# EAGLE design DicioBkUP (EAGLE 7.5.0)
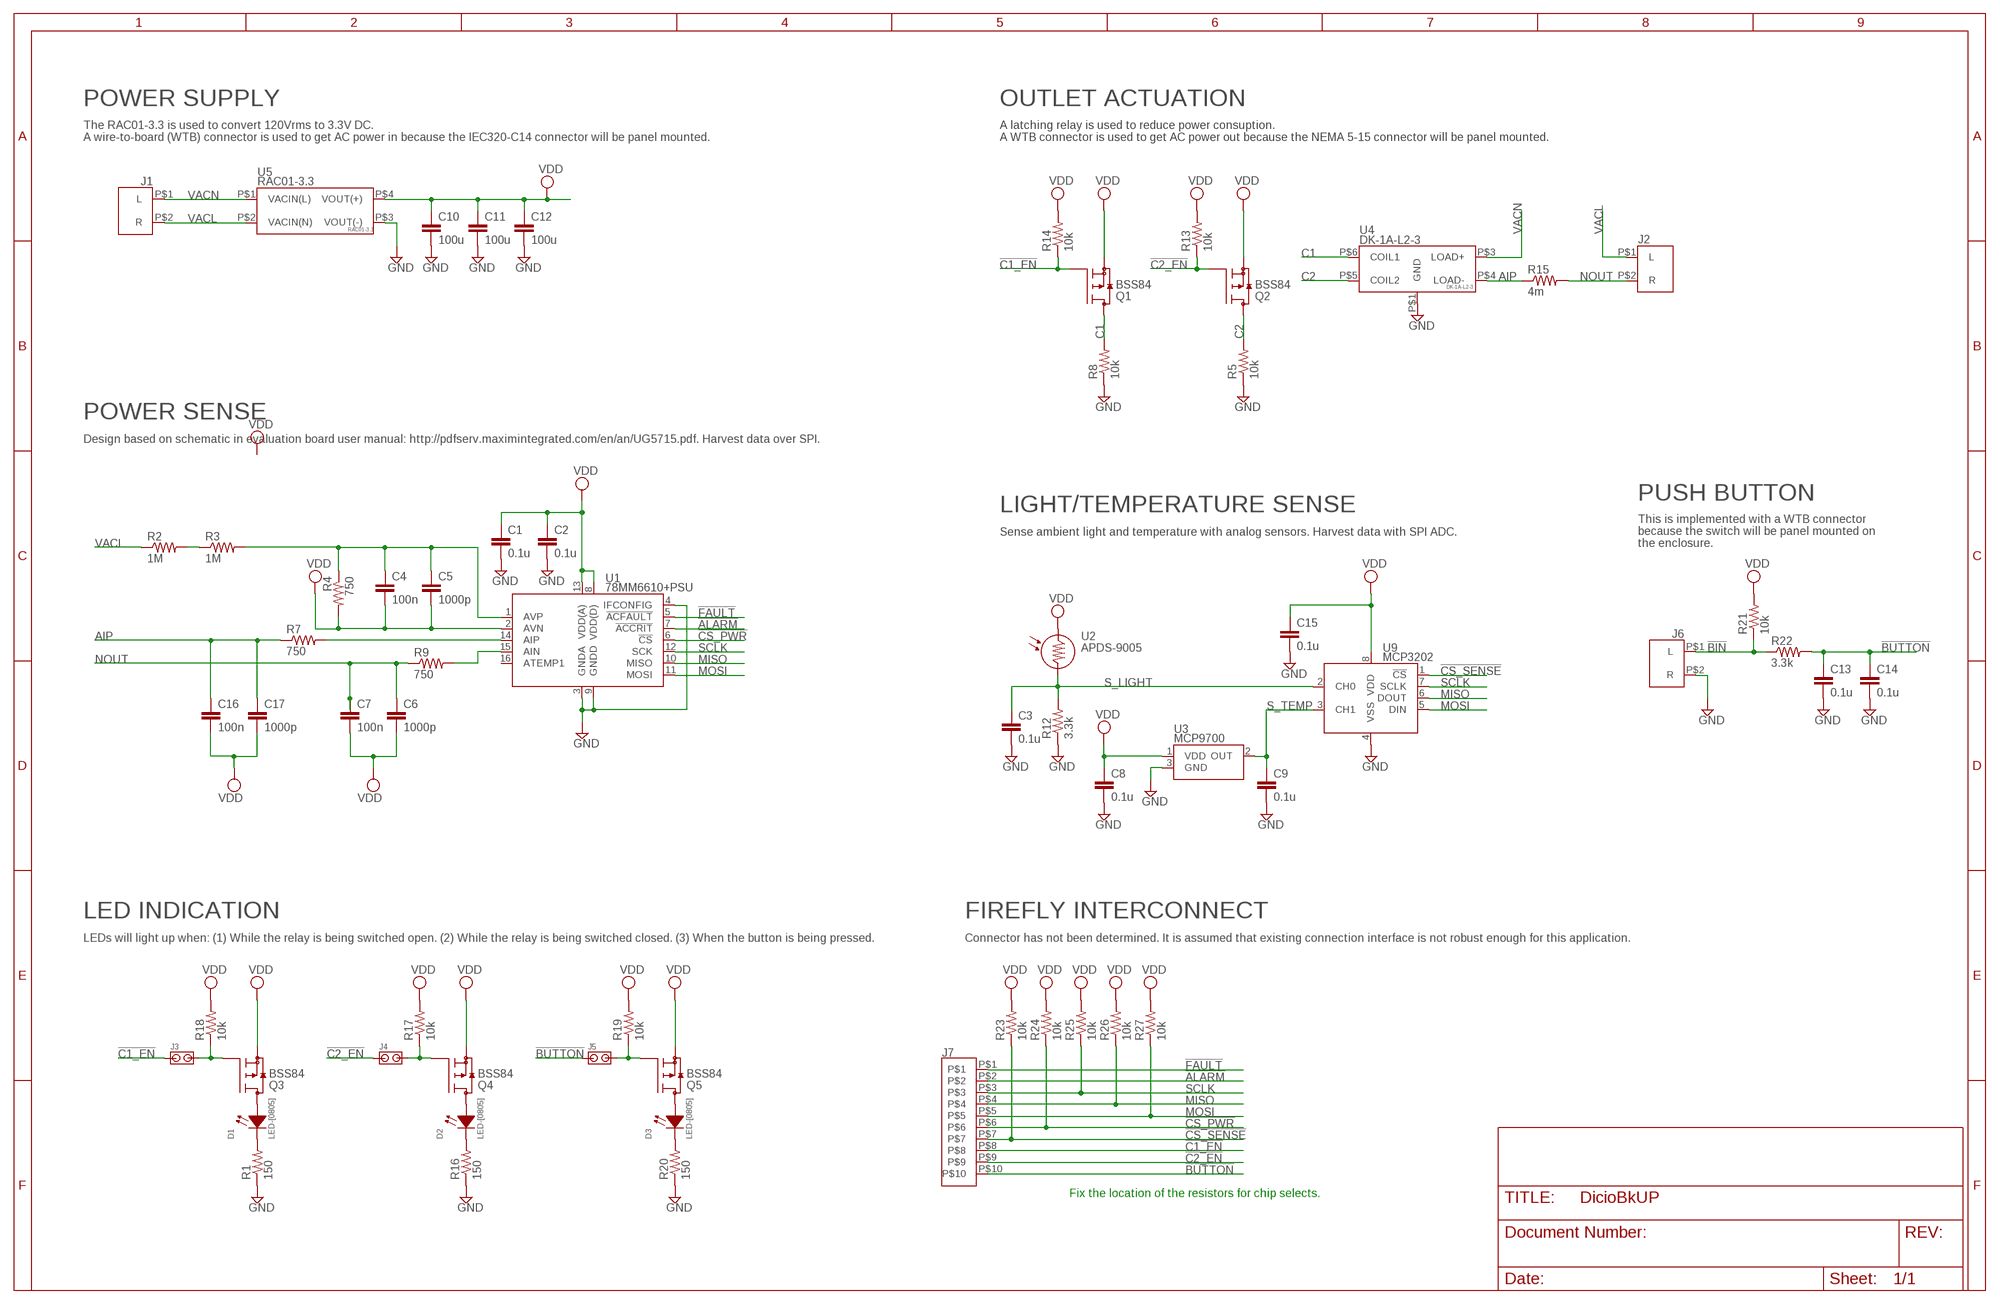
[diagram p0: schematic, sheet 1]

## Parts
C1  0.1u  C-EUC0805  [C0805]
C2  0.1u  C-EUC0805  [C0805]
C3  0.1u  C-EUC0805  [C0805]
C4  100n  C-EUC0805  [C0805]
C5  1000p  C-EUC0805  [C0805]
C6  1000p  C-EUC0805  [C0805]
C7  100n  C-EUC0805  [C0805]
C8  0.1u  C-EUC0805  [C0805]
C9  0.1u  C-EUC0805  [C0805]
C10  100u  C-EUC1206  [C1206]
C11  100u  C-EUC1206  [C1206]
C12  100u  C-EUC1206  [C1206]
C13  0.1u  C-EUC0805  [C0805]
C14  0.1u  C-EUC0805  [C0805]
C15  0.1u  C-EUC0805  [C0805]
C16  100n  C-EUC0805  [C0805]
C17  1000p  C-EUC0805  [C0805]
D1  LED-[0805]  [L0805]
D2  LED-[0805]  [L0805]
D3  LED-[0805]  [L0805]
J1  WTB-2  [[TERM][2][0.2]]
J2  WTB-2  [[TERM][2][0.2]]
J3  JMP2  [JMP2]
J4  JMP2  [JMP2]
J5  JMP2  [JMP2]
J6  WTB-2  [[TERM][2][0.2]]
J7  TERM10  [TERM10]
Q1  BSS84  [SOT23]
Q2  BSS84  [SOT23]
Q3  BSS84  [SOT23]
Q4  BSS84  [SOT23]
Q5  BSS84  [SOT23]
R1  150  R-US_R0805  [R0805]
R2  1M  R-US_R0805  [R0805]
R3  1M  R-US_R0805  [R0805]
R4  750  R-US_R0805  [R0805]
R5  10k  R-US_R0805  [R0805]
R7  750  R-US_R0805  [R0805]
R8  10k  R-US_R0805  [R0805]
R9  750  R-US_R0805  [R0805]
R12  3.3k  R-US_R0805  [R0805]
R13  10k  R-US_R0805  [R0805]
R14  10k  R-US_R0805  [R0805]
R15  4m  R-US_R2512  [R2512]
R16  150  R-US_R0805  [R0805]
R17  10k  R-US_R0805  [R0805]
R18  10k  R-US_R0805  [R0805]
R19  10k  R-US_R0805  [R0805]
R20  150  R-US_R0805  [R0805]
R21  10k  R-US_R0805  [R0805]
R22  3.3k  R-US_R0805  [R0805]
R23  10k  R-US_R0805  [R0805]
R24  10k  R-US_R0805  [R0805]
R25  10k  R-US_R0805  [R0805]
R26  10k  R-US_R0805  [R0805]
R27  10k  R-US_R0805  [R0805]
U1  78MM6610+PSU  [TSSOP16]
U2  APDS-9005  [APDS-9005]
U3  MCP9700  [SOT23]
U4  DK-1A-L2-3  [DK-1A-L2-3]
U5  RAC01-3.3  [RAC01-3.3]
U9  MCP3202  [MSOP-8[MCP3202]]

## Nets
!ALARM!: J7.P$2 U1.7(!ACCRIT!)
!BIN!: J6.P$1(L) R21.1 R22.1
!BUTTON!: C13.1 C14.1 J5.P$2 J7.P$10 R22.2
!C1_EN!: J3.P$2 J7.P$8 Q1.1(G) R14.1
!C2_EN!: J4.P$2 J7.P$9 Q2.1(G) R13.1
!CS_PWR!: J7.P$6 R24.1 U1.6(!CS!)
!CS_SENSE!: J7.P$7 R23.1 U9.1(!CS!)
!FAULT!: J7.P$1 U1.5(!ACFAULT!)
AIP: C16.1 C17.1 R7.1 R15.1 U4.P$4(LOAD-)
C1: Q1.3(D) R8.2 U4.P$6(COIL1)
C2: Q2.3(D) R5.2 U4.P$5(COIL2)
GND: C1.2 C2.2 C3.2 C8.2 C9.2 C10.2 C11.2 C12.2 C13.2 C14.2 C15.2 J6.P$2(R) R1.1 R5.1 R8.1 R12.1 R16.1 R20.1 U1.3(GNDA) U1.4(IFCONFIG) U1.9(GNDD) U3.3(GND) U4.P$1(GND) U5.P$3(VOUT(-)) U9.4(VSS)
MISO: J7.P$4 R26.1 U1.10(MISO) U9.6(DOUT)
MOSI: J7.P$5 R27.1 U1.11(MOSI) U9.5(DIN)
N$1: C4.1 C5.1 R3.2 R4.1 U1.1(AVP)
N$2: J3.P$1 Q3.1(G) R18.1
N$3: R2.2 R3.1
N$5: D2.1(A) Q4.3(D)
N$6: J4.P$1 Q4.1(G) R17.1
N$7: D1.1(A) Q3.3(D)
N$10: D1.2(C) R1.2
N$11: D2.2(C) R16.2
N$12: J5.P$1 Q5.1(G) R19.1
N$13: D3.1(A) Q5.3(D)
N$14: D3.2(C) R20.2
N$15: R7.2 U1.14(AIP)
N$17: R9.2 U1.15(AIN)
NOUT: C6.1 C7.1 J2.P$2(R) R9.1 R15.2
S_LIGHT: C3.1 R12.2 U2.6(ROUT) U9.2(CH0)
S_TEMP: C9.1 U3.2(OUT) U9.3(CH1)
SCLK: J7.P$3 R25.1 U1.12(SCK) U9.7(SCLK)
VACL: J1.P$2(R) J2.P$1(L) R2.1 U5.P$2(VACIN(N))
VACN: J1.P$1(L) U4.P$3(LOAD+) U5.P$1(VACIN(L))
VDD: C1.1 C2.1 C4.2 C5.2 C6.2 C7.2 C8.1 C10.1 C11.1 C12.1 C15.1 C16.2 C17.2 Q1.2(S) Q2.2(S) Q3.2(S) Q4.2(S) Q5.2(S) R4.2 R13.2 R14.2 R17.2 R18.2 R19.2 R21.2 R23.2 R24.2 R25.2 R26.2 R27.2 U1.2(AVN) U1.8(VDD(D)) U1.13(VDD(A)) U2.1(VDD) U3.1(VDD) U5.P$4(VOUT(+)) U9.8(VDD)
Unconnected: U1.16(ATEMP1) U2.2(NC1) U2.3(NC2) U2.4(NC3) U2.5(NC4)

## Notes on the sheet
- POWER SUPPLY | OUTLET ACTUATION
- The RAC01-3.3 is used to convert 120Vrms to 3.3V DC.
  A wire-to-board (WTB) connector is used to get AC power in because the IEC320-C14 connector will be panel mounted.
- A latching relay is used to reduce power consuption.
  A WTB connector is used to get AC power out because the NEMA 5-15 connector will be panel mounted.
- POWER SENSE
- Design based on schematic in evaluation board user manual: http://pdfserv.maximintegrated.com/en/an/UG5715.pdf. Harvest data over SPI.
- PUSH BUTTON
- LIGHT/TEMPERATURE SENSE
- Sense ambient light and temperature with analog sensors. Harvest data with SPI ADC.
- This is implemented with a WTB connector
  because the switch will be panel mounted on 
  the enclosure.
- LED INDICATION | FIREFLY INTERCONNECT
- LEDs will light up when: (1) While the relay is being switched open. (2) While the relay is being switched closed. (3) When the button is being pressed. | Connector has not been determined. It is assumed that existing connection interface is not robust enough for this application.
- Fix the location of the resistors for chip selects.

## Library data of the parts
C1-C9 C13-C17 = resistor:C-EU: CAPACITOR, European symbol; DKPN: 399-1249-1-ND
C10-C12 = resistor:C-EU: CAPACITOR, European symbol; DKPN: 490-7217-1-ND
D1 = TORO:LED-[0805]; COLOR: GREEN; DKPN: 160-1218-1-ND
D2 = TORO:LED-[0805]; COLOR: RED; DKPN: 475-1415-1-ND
D3 = TORO:LED-[0805]; COLOR: YELLOW; DKPN: 475-2560-1-ND
J1 J2 J6 = TORO:WTB-2; DKPN: ED2580-ND
J3-J5 = TORO:JMP2; DKPN: S1011EC-02-ND
J7 = TORO:TERM10
Q1-Q5 = TORO:BSS84; DKPN: BSS84CT-ND
R1 R16 R20 = resistor:R-US_: RESISTOR, American symbol; DKPN: 311-150ARCT-ND
R2 R3 = resistor:R-US_: RESISTOR, American symbol; DKPN: 311-1.00MCRCT-ND
R4 R7 R9 = resistor:R-US_: RESISTOR, American symbol; DKPN: 311-750ARCT-ND
R5 R8 R13 R14 R17-R19 R21 R23-R27 = resistor:R-US_: RESISTOR, American symbol; DKPN: 311-10KARCT-ND
R12 R22 = resistor:R-US_: RESISTOR, American symbol; DKPN: 311-3.30KCRCT-ND
R15 = resistor:R-US_: RESISTOR, American symbol; DKPN: 696-1181-1-ND
U1 = TORO:78MM6610+PSU; DKPN: 78M6610+PSU/C48-ND
U2 = TORO:APDS-9005; DKPN: 516-1717-1-ND
U3 = TORO:MCP9700; DKPN: MCP9700T-E/TTCT-ND
U4 = TORO:DK-1A-L2-3; DKPN: 255-2053-ND
U5 = TORO:RAC01-3.3; DKPN: 945-1400-5-ND
U9 = TORO:MCP3202; DKPN: MCP3202-CI/SN-ND

## Board
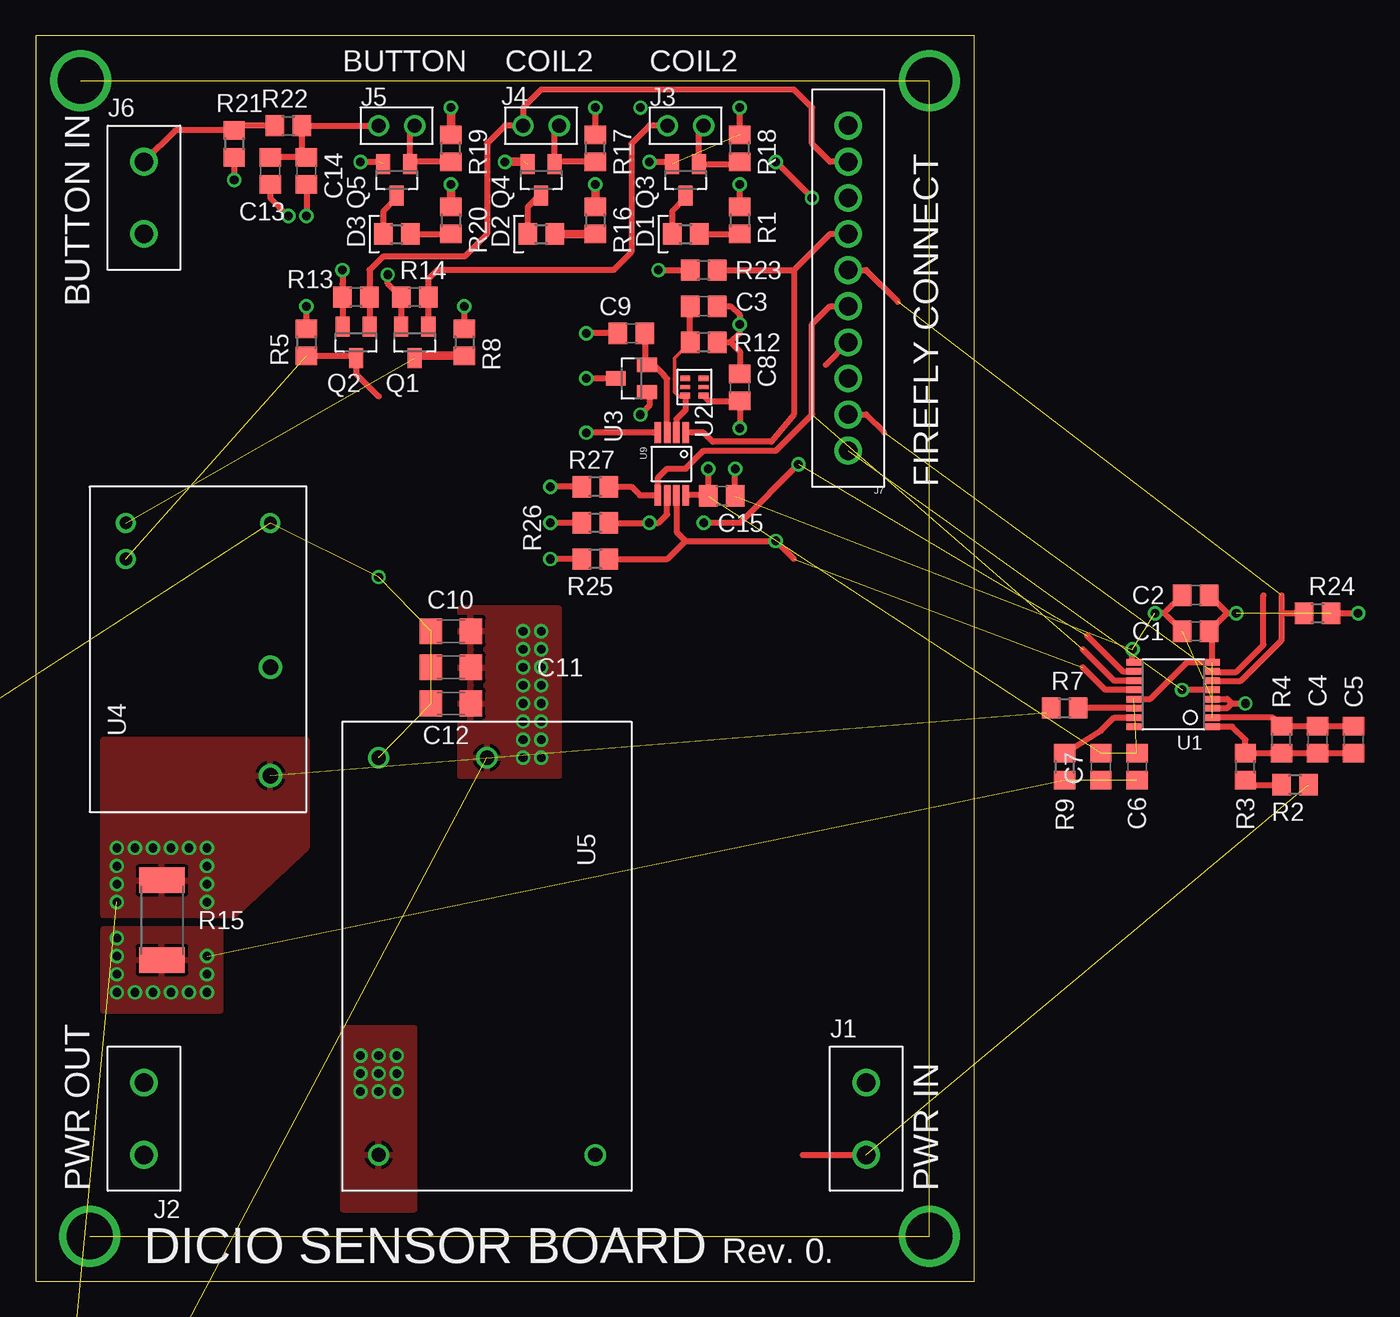
[diagram p1: board, top side]
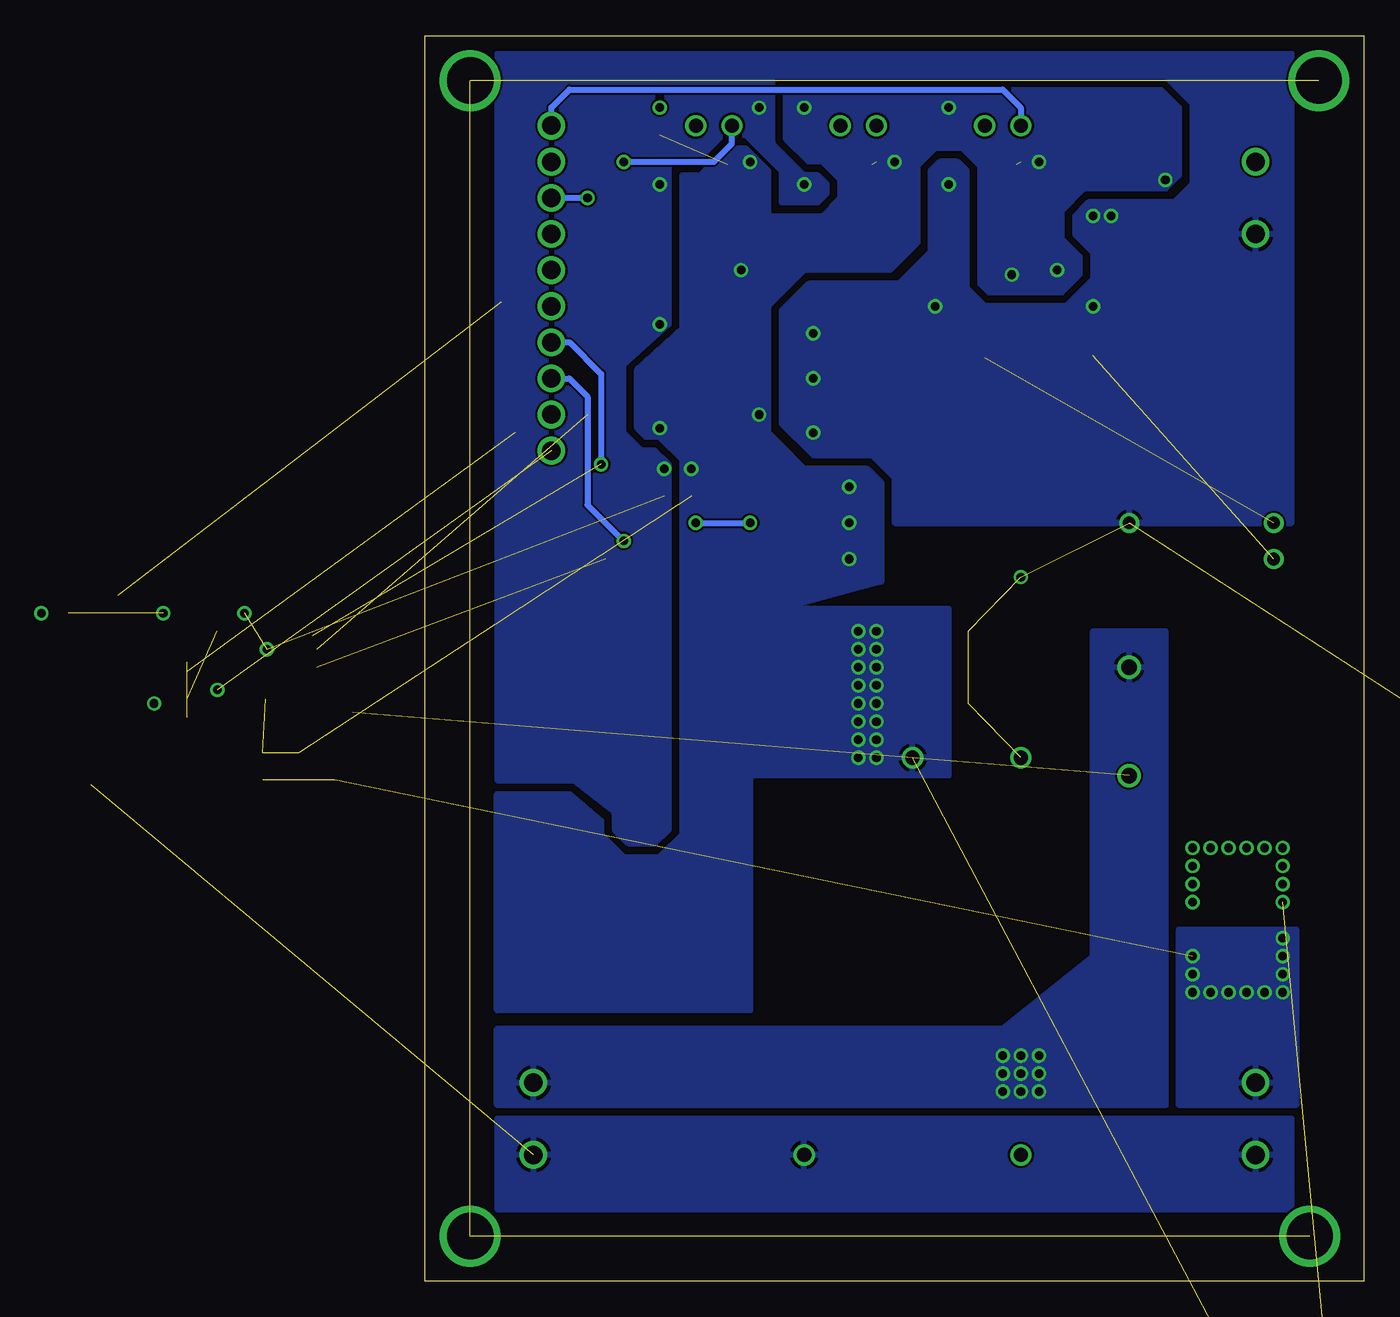
[diagram p2: board, bottom side, seen from below]

Size 66.04 x 87.62 mm. Coordinates in mm from the lower left corner, seen from the top.
Outline: 0,0 66.04,0 66.04,87.62 0,87.62 0,0
Copper layers (1*16): Top 0.035mm / dielectric 1.5mm / Bottom 0.035mm
Design rules "default *": minimum track width 10mil, minimum drill 20mil, track to track 6mil, track to pad 6mil, pad to pad 6mil, via to via 6mil, smd to smd 6mil, copper to edge 40mil, drill to drill 8mil, minimum pad ring 10mil, minimum via ring 8mil, stop-mask expansion 4mil, vias tented up to drill 0mil, thermal gap 10mil

### Footprints (pad centres in the part's own frame; a part is rotated, then mirrored left to right if it is on the bottom)
C0805 = smd 1.3 x 1.5: 1 -0.95,0; 2 0.95,0
C1206 = smd 1.6 x 1.8: 1 -1.4,0; 2 1.4,0
L0805 = smd 1.3 x 1.5: 1 -0.95,0; 2 0.95,0
[TERM][2][0.2] = drill 1.3: P$1 0,0; P$2 0,-5.08
JMP2 = drill 0.991: P$1 0,0; P$2 0,-2.54
TERM10 = drill 1.3: P$1 0,0; P$2 0,-2.54; P$3 0,-5.08; P$4 0,-7.62; P$5 0,-10.16; P$6 0,-12.7; P$7 0,-15.24; P$8 0,-17.78; P$9 0,-20.32; P$10 0,-22.86
SOT23 = smd 1 x 1.4: 1 -0.95,-1.1; 2 0.95,-1.1; 3 0,1.1
R0805 = smd 1.3 x 1.5: 1 -0.95,0; 2 0.95,0
R2512 = smd 1.8 x 3.2: 1 -2.8,0; 2 2.8,0
TSSOP16 = smd 0.45 x 1.05: 1 -2.275,-2.768; 2 -1.625,-2.768; 3 -0.975,-2.768; 4 -0.325,-2.768; 5 0.325,-2.768; 6 0.975,-2.768; 7 1.625,-2.768; 8 2.275,-2.768; 9 2.275,2.768; 10 1.625,2.768; 11 0.975,2.768; 12 0.325,2.768; 13 -0.325,2.768; 14 -0.975,2.768; 15 -1.625,2.768; 16 -2.275,2.768
APDS-9005 = smd 0.4 x 0.7: 1 1.2,0; 3 0,0; 6 1.2,-1.3 | smd 0.3 x 0.7: 2 0.6,0; 5 0.6,-1.3 | smd 0.4 x 0.67: 4 0,-1.3
DK-1A-L2-3 = drill 0.889: P$1 0,0; P$5 2.54,-10.16; P$6 0,-10.16 | drill 1.092: P$3 10.16,0; P$4 17.78,0
RAC01-3.3 = drill 1: P$1 0,0; P$2 0,-15.24; P$3 27.94,0; P$4 27.94,-7.62
MSOP-8[MCP3202] = smd 1.45 x 0.45: 1 0,0; 2 0,-0.65; 3 0,-1.3; 4 0,-1.95; 5 4.4,-1.95; 6 4.4,-1.3; 7 4.4,-0.65; 8 4.4,0

### Placement (x,y rotation side)
C1  81.6,45.72 180 top  (outside the outline)
C2  81.6,48.26 180 top  (outside the outline)
C3  46.99,68.58 0 top
C4  90.17,38.1 90 top  (outside the outline)
C5  92.71,38.1 90 top  (outside the outline)
C6  77.47,36.2 90 top  (outside the outline)
C7  74.93,36.2 90 top  (outside the outline)
C8  49.53,62.87 90 top
C9  41.91,66.67 180 top
C10  29.21,45.72 180 top
C11  29.21,43.18 180 top
C12  29.21,40.64 180 top
C13  16.51,78.11 270 top
C14  19.05,78.11 270 top
C15  48.26,55.24 0 top
C16  2.54,-16.51 0 top  (outside the outline)
C17  2.54,-22.86 0 top  (outside the outline)
D1  45.72,73.66 0 top
D2  35.56,73.66 0 top
D3  25.4,73.66 0 top
J1  58.42,13.97 0 top
J2  7.62,8.89 180 top
J3  46.99,81.28 270 top
J4  36.83,81.28 270 top
J5  26.67,81.28 270 top
J6  7.62,78.74 0 top
J7  57.15,58.42 180 top
Q1  26.67,66.04 180 top
Q2  22.54,66.04 180 top
Q3  45.72,77.47 180 top
Q4  35.56,77.47 180 top
Q5  25.4,77.47 180 top
R1  49.53,74.61 270 top
R2  88.58,34.92 180 top  (outside the outline)
R3  85.09,36.2 90 top  (outside the outline)
R4  87.63,38.1 90 top  (outside the outline)
R5  19.05,66.04 270 top
R7  72.39,40.32 0 top  (outside the outline)
R8  30.16,66.04 270 top
R9  72.39,36.2 90 top  (outside the outline)
R12  46.99,66.04 180 top
R13  22.54,69.22 180 top
R14  26.67,69.22 180 top
R15  8.89,25.4 270 top
R16  39.37,74.61 270 top
R17  39.37,79.69 90 top
R18  49.53,79.69 90 top
R19  29.21,79.69 90 top
R20  29.21,74.61 270 top
R21  13.97,80.01 270 top
R22  17.78,81.28 0 top
R23  46.99,71.12 180 top
R24  90.17,46.99 0 top  (outside the outline)
R25  39.37,50.8 180 top
R26  39.37,53.34 180 top
R27  39.37,55.88 180 top
U1  80.01,41.27 90 top  (outside the outline)
U2  46.99,63.5 270 top
U3  41.91,63.5 90 top
U4  16.51,53.34 270 top
U5  24.13,8.89 90 top
U9  45.72,59.69 270 top

### Tracks (layer width: path | path; a pad name or v marks a point on that pad's centre or on a via)
!ALARM!  (1 unrouted)
  Top 0.406: U1.7 82.81,42.86 84.45,42.86 86.36,44.77 86.36,48.26 | J7.P$2 58.42,60.96 59.69,59.69
!BIN!
  Top 0.406: R22.1 14.29,81.28 | R21.1 9.84,80.96 J6.P$1
  Top 0.61: 14.29,81.28 R21.1
!BUTTON!
  Top 0.406: J5.P$2 R22.2 18.73,79.38 | C14.1 C13.1
  Top 0.61: 18.73,79.38 C14.1
  Bottom 0.406: J7.P$10 57.15,82.55 55.88,83.82 25.4,83.82 24.13,82.55 J5.P$2
!C1_EN!  (via drill 0.6)
  Top 0.406: R14.1 Q1.1 | J3.P$2 43.18,81.28 41.91,80.01 41.91,72.39 40.64,71.12 28.26,71.12 27.62,70.48 R14.1 | v54.61,76.2 v52.07,78.74
  Top 0.61: 27.79,67.31 Q1.1 | R14.1
  Bottom 0.406: J7.P$8 v54.61,76.2 | v52.07,78.74 45.72,78.74 44.45,80.01 J3.P$2
!C2_EN!
  Top 0.406: R13.1 Q2.1 | R13.1 23.5,71.12 24.45,72.07 30.16,72.07 31.75,73.66 31.75,80.01 33.02,81.28 J4.P$2 34.29,82.55 35.56,83.82 53.34,83.82 54.61,82.55 54.61,80.01 55.88,78.74 J7.P$9
  Top 0.61: R13.1
!CS_PWR!  (1 unrouted)
  Top 0.406: U1.6 83.07,42.23 84.77,42.23 87.63,45.09 87.63,46.99 | J7.P$6 58.42,71.12 60.64,68.9 | 87.63,48.26 87.63,46.99 | 87.63,46.99 R24.1
!CS_SENSE!
  Top 0.406: J7.P$7 55.88,73.66 53.34,71.12 | 53.34,71.12 53.34,60.96 51.75,59.05 47.62,59.05 46.99,59.69 U9.1 | R23.1 53.34,71.12
!FAULT!  (via drill 0.6)  (1 unrouted)
  Top 0.406: U1.5 v80.64,41.59
AIP  (via drill 0.6)  (3 unrouted)
  Top 0.406: R7.1 71.12,40.01 71.12,40.32
  other vias: 5.71,27.94 5.71,26.67 5.71,29.21 5.71,30.48 6.99,30.48 8.26,30.48 9.53,30.48 10.79,30.48 12.06,30.48 12.06,29.21 12.06,27.94 12.06,26.67
  pour Top: 4.76,25.72 4.76,38.1 19.05,38.1 19.05,30.48 13.97,25.72
C1  (1 unrouted)
  Top 0.61: R8.2 26.82,65.09 Q1.3
C2  (1 unrouted)
  Top 0.406: R5.2 22.39,65.09 | Q2.3 22.54,63.82 24.13,62.23
  Top 0.61: 22.39,65.09 Q2.3
GND  (via drill 0.6)  (9 unrouted)
  Top 0.406: C14.2 v19.05,74.93 | R1.1 v49.53,77.15 | R5.1 v19.05,68.58 | R8.1 v30.16,68.58 | C13.2 16.51,76.2 v17.78,74.93 | C9.2 v38.73,66.67 | U3.3 v38.73,63.5 | U9.4 43.81,59.65 43.5,59.69 v38.73,59.69 | C15.2 v49.21,57.15 | C3.2 48.9,68.58 49.53,67.94 v49.53,67.31 49.53,66.67 48.9,66.04 | R12.1 48.9,66.04 | 48.9,66.04 49.53,65.41 C8.2 | U1.3 82.8,40.32 83.82,40.32 84.14,40.64 | U1.4 83.82,40.96 84.14,40.64 | 84.14,40.64 v85.09,40.64 | C2.2 79.38,46.99 | 79.38,46.99 v78.74,46.99 | U1.9 77.15,43.64 v77.15,44.45 | 79.38,46.99 C1.2
  Top 0.61: v29.21,77.15 R20.1 | v39.37,77.15 R16.1
  other vias: -8.89,36.83 -10.16,36.83 42.55,82.55 -7.62,36.83 -6.35,36.83 -5.08,36.83 -5.08,38.1 -7.62,38.1 -6.35,38.1 -8.89,38.1 -10.16,38.1 -10.16,39.37 -8.89,39.37 -7.62,39.37 24.13,49.53 -5.08,39.37
  pour Top: -4.45,35.56 -4.45,40.32 -10.79,40.32 -10.79,35.56
  pour Bottom: 33.02,56.52 33.02,53.34 5.08,53.34 5.08,86.36 60.96,86.36 60.96,35.24 55.56,35.24 52.7,33.02 52.7,31.75 51.75,30.8 49.85,30.8 48.9,31.75 48.9,57.47 49.85,58.42 50.8,58.42 52.07,59.69 52.07,64.45 48.9,67.31 48.9,78.74 46.99,78.74 45.09,80.64 43.5,80.64 40.96,78.11 40.96,75.88 38.42,75.88 37.78,76.52 37.78,77.15 38.42,77.79 39.37,77.79 41.59,80.01 41.59,84.77 13.97,84.77 12.06,82.87 12.06,77.15 13.34,75.88 19.37,75.88 20.32,74.93 20.32,73.66 19.05,72.39 19.05,70.48 20.95,68.58 26.67,68.58 27.94,69.85 27.94,78.11 28.57,78.74 29.84,78.74 30.48,78.11 30.48,72.39 32.7,70.17 39.05,70.17 40.96,68.26 40.96,60.33 38.73,58.1 34.61,58.1
MISO  (via drill 0.6)  (1 unrouted)
  Top 0.406: v53.66,57.47 49.53,53.34 v46.99,53.34 | R26.1 v43.18,53.34 43.81,53.34 44.42,53.95 U9.6 | U1.10 77.2,42.86 76.52,42.86 73.98,45.4 | 55.56,64.45 J7.P$4
  Bottom 0.406: J7.P$4 55.88,66.04 53.66,63.82 v53.66,57.47 | v46.99,53.34 v43.18,53.34
MOSI  (1 unrouted)
  Top 0.406: U1.11 77.22,42.23 75.88,42.23 73.66,44.45 | J7.P$5 55.88,68.58 54.61,67.31 54.61,60.96 52.07,58.42 46.99,58.42 45.72,57.15 44.4,57.15 43.79,56.54 43.79,55.27 U9.5 42.5,55.29 41.91,55.88 R27.1
N$1
  Top 0.406: U1.1 84.19,39 85.09,38.1 R3.2 R4.1 C4.1 C5.1
N$2
  Top 0.406: J3.P$1 46.67,80.96 Q3.1 49.36,78.57
  Top 0.61: 49.36,78.57 R18.1
N$3
  Top 0.406: R3.1 85.41,34.92 R2.2
N$4  (via drill 3.26)  (3 unrouted)
  other vias: 3.17,84.45 62.87,84.45 62.87,3.17 3.81,3.17
N$5
  Top 0.406: 35.41,76.37 34.61,75.56 D2.1
  Top 0.61: Q4.3 35.41,76.37 | D2.1
N$6
  Top 0.406: R17.1 36.68,78.74 | Q4.1 36.51,80.96 J4.P$1
  Top 0.61: 36.68,78.74 Q4.1
N$7
  Top 0.406: 45.72,76.2 44.77,75.25 D1.1
  Top 0.61: Q3.3 45.72,76.2 | D1.1
N$10
  Top 0.406: D1.2 R1.2
  Top 0.61: R1.2
N$11
  Top 0.61: D2.2 R16.2
N$12
  Top 0.406: Q5.1 26.35,80.96 J5.P$1 | R19.1 26.52,78.74
  Top 0.61: 26.52,78.74 Q5.1
N$13
  Top 0.406: 25.4,76.2 24.45,75.25 D3.1
  Top 0.61: Q5.3 25.4,76.2 | D3.1
N$14
  Top 0.406: D3.2 R20.2
  Top 0.61: R20.2
N$15
  Top 0.406: U1.14 77.22,40.32 R7.2
N$17
  Top 0.406: 77.2,39.69 U1.15 75.84,39.65 74.93,38.73 R9.2
NOUT  (via drill 0.6)  (3 unrouted)
  other vias: 5.71,24.13 5.71,22.86 5.71,21.59 5.71,20.32 6.99,20.32 8.26,20.32 9.53,20.32 10.79,20.32 12.06,20.32 12.06,21.59 12.06,22.86
  pour Top: 4.76,24.77 4.76,19.05 13.02,19.05 13.02,24.77
  pour Bottom: 13.02,12.38 13.02,24.77 4.76,24.77 4.76,12.38
S_LIGHT
  Top 0.254: 45.72,62.23 45.24,62.23 44.93,62.55 44.93,64.45 44.93,64.93 R12.2
  Top 0.406: R12.2 C3.1 | U2.6 45.72,62.27 45.72,62.23 45.72,61.28 45.07,60.63 U9.2
S_TEMP
  Top 0.406: C9.1 42.86,64.6 U3.2 43.5,64.45 44.13,63.82 44.42,63.47 U9.3
SCLK  (via drill 0.6)  (1 unrouted)
  Top 0.406: R25.1 44.45,50.8 45.72,52.07 | U9.7 45.09,55.27 45.09,52.7 45.72,52.07 | 45.72,52.07 v52.07,52.07 53.34,50.8 | U1.12 75.25,41.59 73.66,43.18
  Bottom 0.406: J7.P$3 55.88,63.5 54.61,62.23 54.61,54.61 v52.07,52.07
VACL  (1 unrouted)
  Top 0.406: 53.98,8.89 J1.P$2
  pour Bottom: 60.96,11.43 60.96,5.08 5.08,5.08 5.08,11.43
VACN  (via drill 0.6)
  other vias: 24.13,13.34 22.86,13.34 25.4,13.34 22.86,14.61 24.13,14.61 25.4,14.61 25.4,15.88 24.13,15.88 22.86,15.88
  pour Bottom: 25.4,17.78 19.05,22.86 19.05,45.72 13.97,45.72 13.97,12.38 60.96,12.38 60.96,17.78
  pour Top: 21.59,17.78 21.59,5.08 26.67,5.08 26.67,17.78
VDD  (via drill 0.6)  (10 unrouted)
  Top 0.406: Q2.2 R13.2 21.59,70.17 v21.59,71.12 | Q1.2 R14.2 24.77,70.17 v24.77,70.8 | v22.86,78.74 24.13,78.74 | R17.2 v39.37,82.55 | v43.18,78.74 44.6,78.74 | R18.2 v49.53,82.55 | R21.2 v13.97,77.47 | U3.1 43.18,62.38 43.18,61.59 v42.55,60.96 | U9.8 47.27,55.29 C15.1 47.31,56.83 v47.31,57.15 | U2.1 47.38,61.91 C8.1 v49.53,60.01 | U1.13 78.42,40.96 81.02,43.55 U1.8 82.78,45.49 | 83.82,46.99 C2.1 | 82.78,45.49 83.01,45.72 | 82.78,45.49 C1.1 83.82,46.99 | 83.82,46.99 v84.45,46.99 | R24.2 v93.03,46.99 | R27.2 v36.2,55.88 | R26.2 v36.2,53.34 | v43.81,71.12 R23.2 | R25.2 v36.2,50.8 | U1.2 87.03,39.65 R4.2 C4.2 C5.2
  Top 0.61: v29.21,82.55 R19.2 | v33.02,78.74 34.29,78.74 | 44.6,78.74 Q3.2
  other vias: 34.29,40.64 34.29,39.37 34.29,41.91 34.29,43.18 34.29,44.45 34.29,45.72 35.56,45.72 35.56,44.45 35.56,43.18 35.56,41.91 35.56,40.64 35.56,39.37 35.56,38.1 35.56,36.83 34.29,36.83 34.29,38.1
  pour Top: 29.84,35.56 33.02,35.56 35.56,38.1 35.56,47.31 29.84,47.31
  pour Top: 29.84,35.56 36.83,35.56 36.83,47.31 29.84,47.31
  pour Bottom: 39.37,57.15 34.92,57.15 33.97,56.2 33.97,49.21 40.96,47.31 29.21,47.31 29.21,35.56 43.18,35.56 43.18,19.05 60.96,19.05 60.96,34.29 55.88,34.29 53.66,32.38 53.66,31.43 52.07,29.84 49.53,29.84 47.94,31.43 47.94,57.78 49.53,59.37 50.48,59.37 51.12,60.01 51.12,64.14 47.94,66.99 47.94,77.79 46.67,77.79 44.77,79.69 43.5,79.69 41.91,78.11 41.91,74.93 38.1,74.93 36.83,76.2 36.83,77.47 38.1,78.74 39.05,78.74 40.64,80.33 40.64,83.82 14.29,83.82 13.02,82.55 13.02,77.79 13.97,76.83 19.68,76.83 21.27,75.25 21.27,73.34 20,72.07 20,70.8 21.27,69.53 26.35,69.53 26.99,70.17 26.99,78.42 28.26,79.69 30.16,79.69 31.43,78.42 31.43,73.03 33.34,71.12 39.37,71.12 41.91,68.58 41.91,59.69

### Text on the board
tPlace: BUTTON | COIL2 | COIL2 | BUTTON IN | FIREFLY CONNECT | PWR OUT | PWR IN | DICIO SENSOR BOARD | Rev. 0.